# EAGLE schematic new_v1 (EAGLE 9.7.0)
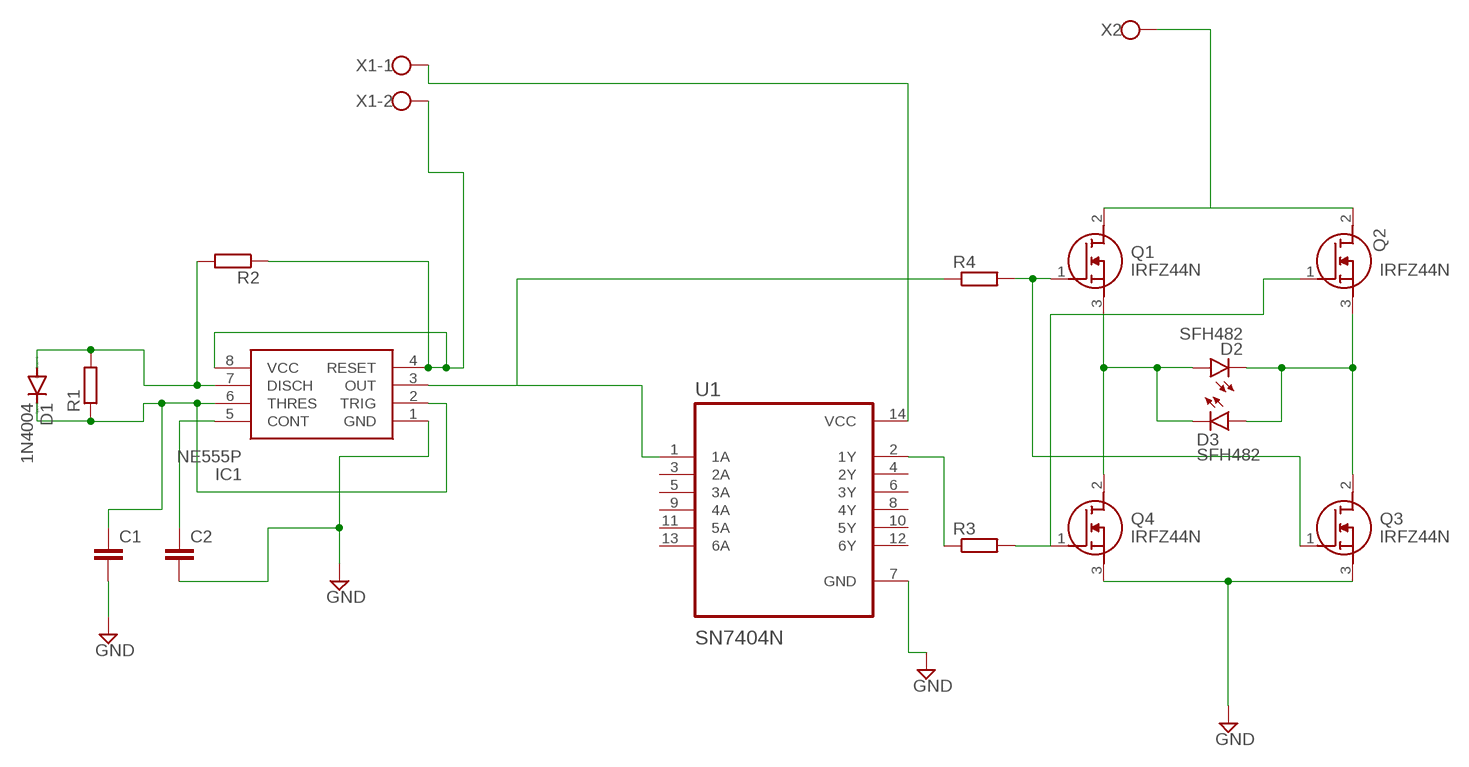
[diagram p0: schematic, sheet 1]

## Parts
C1  C-EU025-030X050  [C025-030X050]
C2  C-EU025-030X050  [C025-030X050]
D1  1N4004  [DO41-10]
D2  SFH482  [SFH482]
D3  SFH482  [SFH482]
IC1  NE555P  [DIP794W53P254L959H508Q8N]
Q1  IRFZ44N  [TO254P440X1000X1900-3P]
Q2  IRFZ44N  [TO254P440X1000X1900-3P]
Q3  IRFZ44N  [TO254P440X1000X1900-3P]
Q4  IRFZ44N  [TO254P440X1000X1900-3P]
R1  R-EU_0207/7  [0207/7]
R2  R-EU_0207/7  [0207/7]
R3  R-EU_0207/7  [0207/7]
R4  R-EU_0207/7  [0207/7]
U1  SN7404N  [DIP794W45P254L1969H508Q14]
X1  W237-102  [W237-102]
X2  W237-112  [W237-112]

## Nets
GND: C1.2 C2.2 IC1.1(GND) Q3.3(S) Q4.3(S) U1.7(GND)
N$1: Q1.1(G) Q3.1(G) R4.2
N$2: C2.1 IC1.5(CONT)
N$3: D1.A IC1.7(DISCH) R1.2 R2.2
N$4: C1.1 D1.C IC1.2(TRIG) IC1.6(THRES) R1.1
N$6: IC1.4(RESET) IC1.8(VCC) R2.1 X1.2
N$7: Q1.2(D) Q2.2(D) X2.1(KL)
N$8: U1.14(VCC) X1.1
N$9: IC1.3(OUT) R4.1 U1.1(1A)
N$11: Q2.1(G) Q4.1(G) R3.2
N$12: D2.K(C) D3.A Q2.3(S) Q3.2(D)
N$13: D2.A D3.K(C) Q1.3(S) Q4.2(D)
N$17: R3.1 U1.2(1Y)
Unconnected: U1.3(2A) U1.4(2Y) U1.5(3A) U1.6(3Y) U1.8(4Y) U1.9(4A) U1.10(5Y) U1.11(5A) U1.12(6Y) U1.13(6A)

## Library data of the parts
C1 C2 = rcl:C-EU: CAPACITOR, European symbol; SPICEPREFIX: C
D1 = diode:1N4004: DIODE general purpose rectifier, 1 A
D2 D3 = led:SFH482: IR LED infrared emitting diode, Infineon
IC1 = NE555P:NE555P: Precision timer,NE555P 0.5MHz DIL8 Texas Instruments NE555P, Precision Timer, 4.5 16 V, 8-Pin PDIP Source: Datasheet <http://www.ti.com/lit/ds/symlink/ne555.pdf>; ARROW_PART_NUMBER: NE555P; ARROW_PRICE-STOCK: https://www.arrow.com/en/products/ne555p/texas-instruments?region=nac; DESCRIPTION: Precision timer,NE555P 0.5MHz DIL8 Texas Instruments NE555P, Precision Timer, 4.5 16 V, 8-Pin PDIP; HEIGHT: 5.08mm; MANUFACTURER_NAME: Texas Instruments; MANUFACTURER_PART_NUMBER: NE555P; MOUSER_PART_NUMBER: 595-NE555P; MOUSER_PRICE-STOCK: https://www.mouser.co.uk/ProductDetail/Texas-Instruments/NE555P?qs=rkhjVJ6%2F3EIf4CWgjIKuKQ%3D%3D
Q1-Q4 = IRFZ44N:IRFZ44N: isc N-Channel MOSFET Transistor Source: Datasheet <https://4donline.ihs.com/images/VipMasterIC/IC/INSE/INSES02201/INSES02201-1.pdf?hkey=EF798316E3902B6ED9A73243A3159BB0>; DESCRIPTION: isc N-Channel MOSFET Transistor; HEIGHT: 4.4mm; MANUFACTURER_NAME: Inchange Semiconductor; MANUFACTURER_PART_NUMBER: IRFZ44N
R1-R4 = rcl:R-EU_: RESISTOR, European symbol; SPICEPREFIX: R
U1 = SN7404N:SN7404N: Check availability <https://pricing.snapeda.com/parts/SN7404N/Texas%20Instruments/view-part?ref=eda>; AVAILABILITY: In Stock; DESCRIPTION: 6-ch, 4.75-V to 5.25-V bipolar inverters; MF: Texas Instruments; MP: SN7404N; PACKAGE: PDIP-14 Texas Instruments; PRICE: None; PURCHASE-URL: https://pricing.snapeda.com/search/part/SN7404N/?ref=eda
X1 = con-wago-500:W237-102: WAGO SCREW CLAMP; MPN: 237-102; OC_FARNELL: unknown; OC_NEWARK: 70K9898
X2 = con-wago-500:W237-112: WAGO SCREW CLAMP; MPN: 237-112; OC_FARNELL: unknown; OC_NEWARK: 76R2974